# Altium project AIC1821 circui.PrjPcb
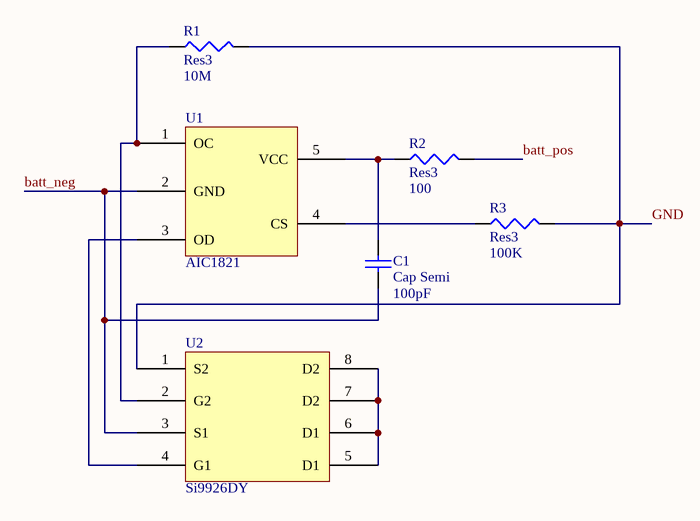
[diagram p0: lion-battery-protection-circuit.SchDoc]
1 sheet, 6 parts. Net scope: global (net labels, ports and power ports of the same name join across sheets).
Board file: li-ion-battery-protection-circuit-PCB.PcbDoc

## Sheet lion-battery-protection-circuit.SchDoc
size A

### Parts
C1  Cap Semi  value 100pF  [CAPC1005M]
R1  Res3  value 10M  [RESC1608M]
R2  Res3  value 100  [RESC1608M]
R3  Res3  value 100K  [RESC1608M]
U1  AIC1821  [SOT23-5AN]
U2  Si9926DY  [SOIC127P600-8BL]

### Nets
batt_neg: C1.1 U1.2(GND) U2.3(S1)
batt_pos: R2.2
GND: R1.2 R3.2 U2.1(S2)
NetC1_2: C1.2 R2.1 U1.5(VCC)
NetR1_1: R1.1 U1.1(OC) U2.2(G2)
NetR3_1: R3.1 U1.4(CS)
NetU1_3: U1.3(OD) U2.4(G1)
NetU2_5: U2.5(D1) U2.6(D1) U2.7(D2) U2.8(D2)

### Library data of the parts
C1 = Cap Semi: LMK105BJ104KV-F; Published: 8-Jun-2000; LatestRevisionDate: 29-May-2009; LatestRevisionNote: IPC-7351 Footprint Added.; PackageReference: C1206; Publisher: Altium Limited; PackageDescription: Chip Capacitor
R1 = Res3: ERJ-3GEYJ106V; Published: 8-Jun-2000; LatestRevisionDate: 29-May-2009; LatestRevisionNote: IPC-7351 Footprint Added.; PackageReference: J1-0603; Publisher: Altium Limited; PackageDescription: Chip Resistor
R2 = Res3: ERJ-3GEYJ101V; Published: 8-Jun-2000; LatestRevisionDate: 29-May-2009; LatestRevisionNote: IPC-7351 Footprint Added.; PackageReference: J1-0603; Publisher: Altium Limited; PackageDescription: Chip Resistor
R3 = Res3: ERJ-3GEYJ104V; Published: 8-Jun-2000; LatestRevisionDate: 29-May-2009; LatestRevisionNote: IPC-7351 Footprint Added.; PackageReference: J1-0603; Publisher: Altium Limited; PackageDescription: Chip Resistor
U1 = Component_1: lithium ion cell protection IC
U2 = Component_1: dual n channel mosfets